# Altium schematic sheet Sense.SchDoc
size 381 x 241 mm; SheetNumber: 3; SheetTotal: 5
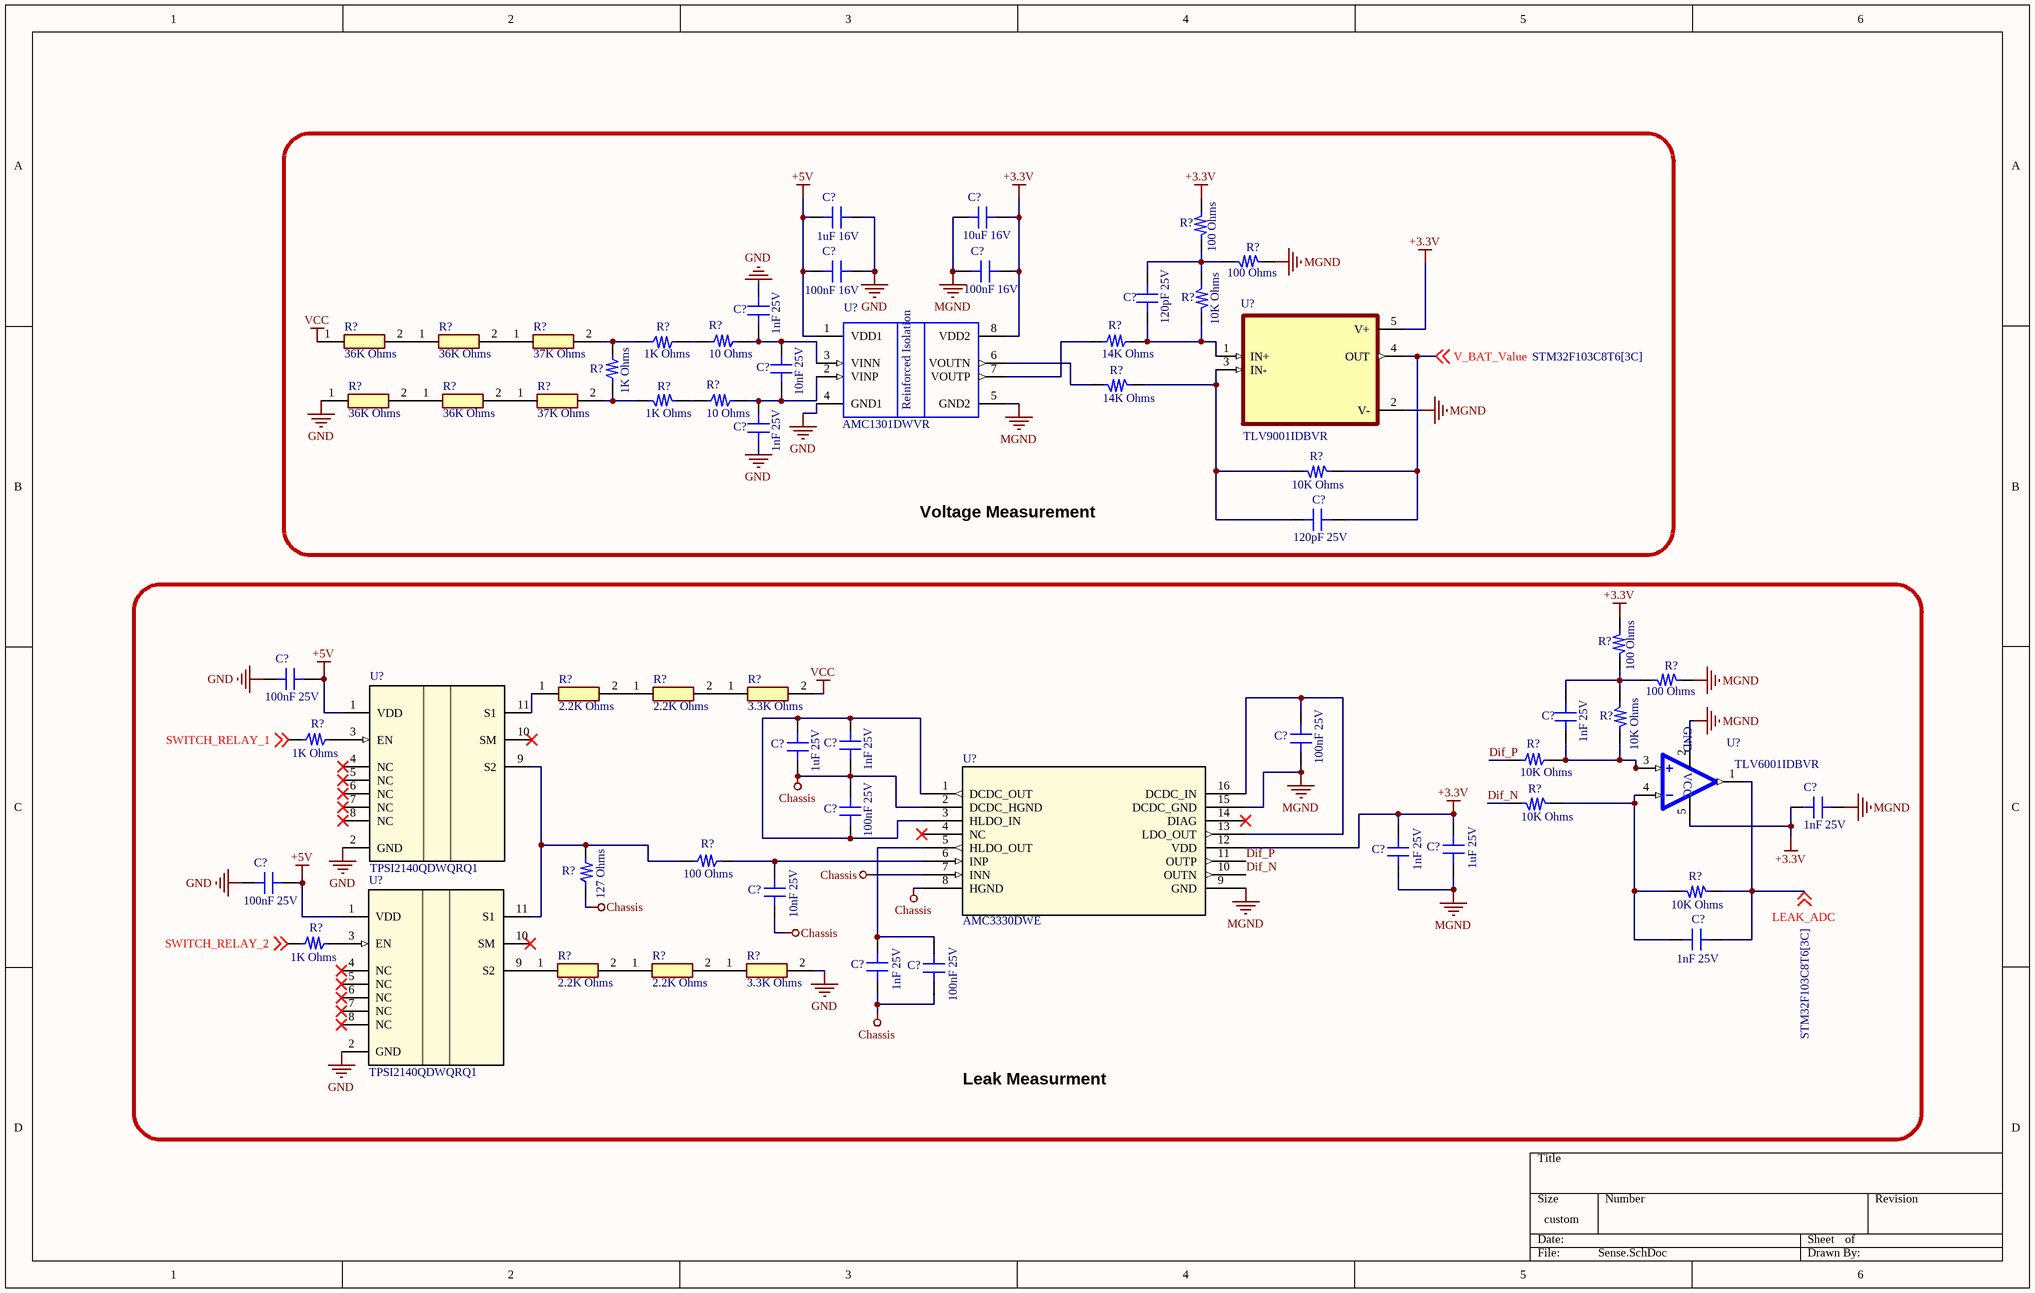
[diagram p0: Sense.SchDoc]

## Parts
(Parts that share a designator on the sheet are numbered #1, #2 ... from top to bottom, then left to right.)
C?#1  1uF 16V  [0805_CAP]
C?#2  10uF 16V  [0805_CAP]
C?#3  100nF 16V  [0805_CAP]
C?#4  100nF 16V  [0805_CAP]
C?#5  120pF 25V  [0603_CAP]
C?#6  1nF 25V  [0603_CAP]
C?#7  10nF 25V  [0603_CAP]
C?#8  1nF 25V  [0603_CAP]
C?#9  120pF 25V  [0603_CAP]
C?#10  100nF 25V  [0603_CAP]
C?#11  1nF 25V  [0603_CAP]
C?#12  100nF 25V  [0603_CAP]
C?#13  1uF 25V  [0603_CAP]
C?#14  1nF 25V  [0603_CAP]
C?#15  1nF 25V  [0603_CAP]
C?#16  100nF 25V  [0603_CAP]
C?#17  1nF 25V  [0603_CAP]
C?#18  1uF 25V  [0603_CAP]
C?#19  100nF 25V  [0603_CAP]
C?#20  10nF 25V  [0603_CAP]
C?#21  1nF 25V  [0603_CAP]
C?#22  1nF 25V  [0603_CAP]
C?#23  100nF 25V  [0603_CAP]
R?#1  100 Ohms  [0603_RES]
R?#2  100 Ohms  [0603_RES]
R?#3  10K Ohms  [0603_RES]
R?#4  36K Ohms  [RESC3216X75N]
R?#5  36K Ohms  [RESC3216X75N]
R?#6  37K Ohms  [RESC3216X75N]
R?#7  1K Ohms  [0805_RES]
R?#8  10 Ohms  [0603_RES]
R?#9  14K Ohms  [0603_RES]
R?#10  14K Ohms  [0603_RES]
R?#11  1K Ohms  [0805_RES]
R?#12  36K Ohms  [RESC3216X75N]
R?#13  36K Ohms  [RESC3216X75N]
R?#14  37K Ohms  [RESC3216X75N]
R?#15  1K Ohms  [0805_RES]
R?#16  10 Ohms  [0603_RES]
R?#17  10K Ohms  [0603_RES]
R?#18  100 Ohms  [0603_RES]
R?#19  100 Ohms  [0603_RES]
R?#20  2.2K Ohms  [RESC3216X75N]
R?#21  2.2K Ohms  [RESC3216X75N]
R?#22  3.3K Ohms  [RESC3216X75N]
R?#23  10K Ohms  [0603_RES]
R?#24  1K Ohms  [0603_RES]
R?#25  10K Ohms  [0603_RES]
R?#26  10K Ohms  [0603_RES]
R?#27  127 Ohms  [0805_RES]
R?#28  100 Ohms  [0805_RES]
R?#29  10K Ohms  [0603_RES]
R?#30  1K Ohms  [0603_RES]
R?#31  2.2K Ohms  [RESC3216X75N]
R?#32  2.2K Ohms  [RESC3216X75N]
R?#33  3.3K Ohms  [RESC3216X75N]
U?#1  AMC1301DWVR  [SOIC127P1150X280-8N]
U?#2  TLV9001IDBVR  [SOT95P280X145-5N]
U?#3  TPSI2140QDWQRQ1  [DWQ0011A-MFG]
U?#4  TLV6001IDBVR  [SOT95P280X145-5N]
U?#5  AMC3330DWE  [SOIC_30DWER_TEX]
U?#6  TPSI2140QDWQRQ1  [DWQ0011A-MFG]

## Blocks framed on the sheet
Voltage Measurement: C?#1-C?#9 R?#1-R?#17 U?#1 U?#2
Leak Measurment: C?#10-C?#23 R?#18-R?#33 U?#3-U?#6

## Nets
+3.3V: C?#2.2 C?#4.2 C?#15.2 C?#17.2 C?#18.2 R?#1.1 R?#18.1 U?#1.8(VDD2) U?#2.5(V+) U?#4.5(V+) U?#5.12(VDD)
+5V: C?#1.2 C?#3.2 C?#10.1 C?#19.1 U?#1.1(VDD1) U?#3.1(VDD) U?#6.1(VDD)
Chassis: C?#13.1 C?#14.1 C?#16.2 C?#20.1 C?#22.1 C?#23.1 R?#27.2 U?#5.2(DCDC_HGND) U?#5.7(INN) U?#5.8(HGND)
GND: C?#1.1 C?#3.1 C?#6.2 C?#8.1 C?#10.2 C?#19.2 R?#12.1 R?#33.2 U?#1.4(GND1) U?#3.2(GND) U?#6.2(GND)
MGND: C?#2.1 C?#4.1 C?#12.1 C?#15.1 C?#17.1 C?#18.1 R?#2.1 R?#19.1 U?#1.5(GND2) U?#2.2(V-) U?#4.2(V-) U?#5.9(GND) U?#5.15(DCDC_GND)
VCC: R?#4.1 R?#22.2
Dif_N: R?#26.1 U?#5.10(OUTN)
Dif_P: R?#25.1 U?#5.11(OUTP)
LEAK_ADC: C?#21.2 R?#29.2 U?#4.1(OUT) ; off-sheet LEAK_ADC
SWITCH_RELAY_1: R?#24.1 ; off-sheet SWITCH_RELAY_1
SWITCH_RELAY_2: R?#30.1 ; off-sheet SWITCH_RELAY_2
V_BAT_Value: C?#9.2 R?#17.2 U?#2.4(OUT) ; off-sheet V_BAT_Value
NetC?#5_1: C?#5.1 R?#3.1 R?#9.2 U?#2.1(IN+)
NetC?#5_2: C?#5.2 R?#1.2 R?#2.2 R?#3.2
NetC?#6_1: C?#6.1 C?#7.2 R?#8.2 U?#1.3(VINN)
NetC?#7_1: C?#7.1 C?#8.2 R?#16.2 U?#1.2(VINP)
NetC?#9_1: C?#9.1 R?#10.2 R?#17.1 U?#2.3(IN-)
NetC?#11_1: C?#11.1 R?#23.1 R?#25.2 U?#4.3(IN+)
NetC?#11_2: C?#11.2 R?#18.2 R?#19.2 R?#23.2
NetC?#12_2: C?#12.2 U?#5.13(LDO_OUT) U?#5.16(DCDC_IN)
NetC?#13_2: C?#13.2 C?#14.2 C?#16.1 U?#5.1(DCDC_OUT) U?#5.3(HLDO_IN)
NetC?#20_2: C?#20.2 R?#28.2 U?#5.6(INP)
NetC?#21_1: C?#21.1 R?#26.2 R?#29.1 U?#4.4(IN-)
NetC?#22_2: C?#22.2 C?#23.2 U?#5.5(HLDO_OUT)
NetR?#4_2: R?#4.2 R?#5.1
NetR?#5_2: R?#5.2 R?#6.1
NetR?#6_2: R?#6.2 R?#7.2 R?#11.2
NetR?#7_1: R?#7.1 R?#8.1
NetR?#9_1: R?#9.1 U?#1.7(VOUTP)
NetR?#10_1: R?#10.1 U?#1.6(VOUTN)
NetR?#11_1: R?#11.1 R?#14.2 R?#15.2
NetR?#12_2: R?#12.2 R?#13.1
NetR?#13_2: R?#13.2 R?#14.1
NetR?#15_1: R?#15.1 R?#16.1
NetR?#20_1: R?#20.1 U?#3.11(S1)
NetR?#20_2: R?#20.2 R?#21.1
NetR?#21_2: R?#21.2 R?#22.1
NetR?#24_2: R?#24.2 U?#3.3(EN)
NetR?#27_1: R?#27.1 R?#28.1 U?#3.9(S2) U?#6.11(S1)
NetR?#30_2: R?#30.2 U?#6.3(EN)
NetR?#31_1: R?#31.1 U?#6.9(S2)
NetR?#31_2: R?#31.2 R?#32.1
NetR?#32_2: R?#32.2 R?#33.1

Not connected (* = marked no-connect by the designer): U?#3 4(NC)* 5(NC)* 6(NC)* 7(NC)* 8(NC)* 10(SM)*; U?#5 4(NC)* 14(DIAG)*; U?#6 4(NC)* 5(NC)* 6(NC)* 7(NC)* 8(NC)* 10(SM)*

## Notes on the sheet
- (in symbol AMC1301DWVR) Reinforced Isolation
- (in symbol TLV6001IDBVR) GND; VCC

## Library data of the parts
C?#1 C?#2 = CAP_0805: Value: 100nF 16V
C?#3 C?#4 = CAP_0805: Value: 100nF 16V
C?#5-C?#23 = CAP_0603: CL10B105KO8NNNC - MLCC (1608) 0603 1uF 16VDC ±10% X7R; Value: 1uF 16V
R?#1-R?#3 R?#8-R?#10 R?#16-R?#19 R?#23-R?#26 R?#29 R?#30 = 0603_res
R?#4-R?#6 R?#12-R?#14 R?#20-R?#22 R?#31-R?#33 = Resistor: 1206 SMD Resistor; Manufacturer_Name: Bourns; Manufacturer_Part_Number: CR1206-F/-2R70ELF; Datasheet Link: https://mail.qq.com/cgi-bin/loginpage?autologin=n&errtype=1&clientuin=895793657&param=&sp=&tfcont=22%20serialization%3A%3Aarchive%2010%200%200%204%200%200%200%208%20authtype%201%204%209%20clientuin%209%20895793657%206%20domain%206%20qq.com%202%20vm%203%20; Height: 0.75mm; Mouser Part Number: 652-CR1206-F/2R70ELF; Mouser Price/Stock: https://www.mouser.co.uk/ProductDetail/Bourns/CR1206-F-2R70ELF?qs=W%2FMpXkg%252BdQ43a7iNS79Iog%3D%3D
R?#7 R?#11 R?#15 = RES_0805: 0805; Power: 1/8 W; Value: 1k Ohms
R?#27 R?#28 = RES_0805: 0805; Value: 1k Ohms; Power: 1/8 W
U?#1 = AMC1301DWVR: 250 mV-Input Precision Reinforced Isolated Amplifier for Current Sensing 8-SOIC -40 to 125; MF: Texas Instruments; Check_prices: https://www.snapeda.com/parts/AMC1301DWVR/Texas+Instruments/view-part/?ref=eda; SnapEDA_Link: https://www.snapeda.com/parts/AMC1301DWVR/Texas+Instruments/view-part/?ref=snap; Availability: In Stock; Price: None; Value: *; MP: AMC1301DWVR; Package: SOIC-8 Texas Instruments; Purchase-URL: https://pricing.snapeda.com/search/part/AMC1301DWVR/?ref=eda
U?#2 = TLV9001IDBVR: 1-Channel, 1MHz, RRIO, 1.8V to 5.5V Operational Amplifier for Cost-Optimized Systems 5-SOT-23 -40 to 125; MF: Texas Instruments; MP: TLV9001IDBVR; Package: SOT-23-5 Texas Instruments; Availability: Good; Price: None; Mouser-Purchase-URL: https://snapeda.com/shop?store=Mouser&id=3210564; Arrow_Electronics-Purchase-URL: https://snapeda.com/shop?store=Arrow+Electronics&id=3210564; Texas_Instruments-Purchase-URL: https://snapeda.com/shop?store=Texas+Instruments&id=3210564; SnapEDA_Link: https://www.snapeda.com/parts/TLV9001IDBVR/Texas%20Instruments/view-part/3210564/?ref=snap; Value: *; BuyPart: https://www.snapeda.com/parts/TLV9001IDBVR/Texas%20Instruments/view-part/3210564/?ref=eda
U?#3 U?#6 = TPSI2140QDWQRQ1: No Description Available; Mfr_Name: Texas Instruments; TYPE: TYPE; RefDes: RefDes
U?#4 = TLV6001IDBVR: Single, 5.5-V, 1-MHz, RRIO operational amplifier; MF: Texas Instruments; SnapEDA_Link: https://www.snapeda.com/parts/TLV6001IDBVR/Texas+Instruments/view-part/?ref=snap; Package: SOT-23-5 Texas Instruments; Value: *; MP: TLV6001IDBVR; Check_prices: https://www.snapeda.com/parts/TLV6001IDBVR/Texas+Instruments/view-part/?ref=eda
U?#5 = AMC3330DWE: No Description Available; Mfr_Name: Texas Instruments; RefDes: RefDes; Type: Type